# Altium project fullwave_rectifier.PrjPcb
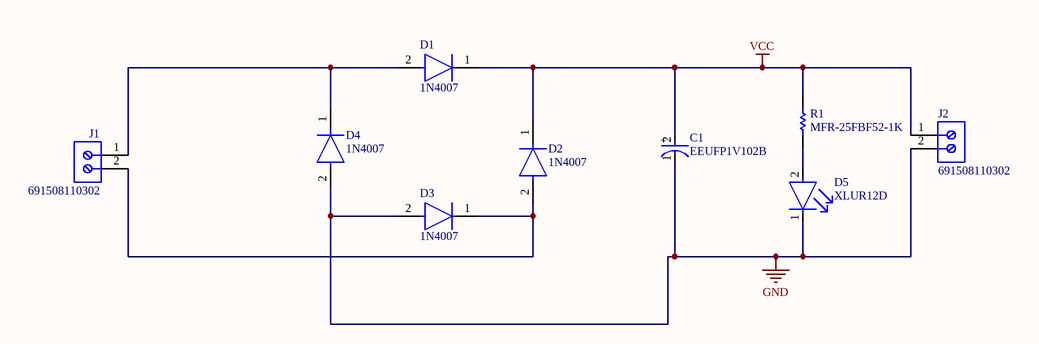
[diagram p0: Sheet1.SchDoc]
1 sheet, 9 parts. Net scope: global (net labels, ports and power ports of the same name join across sheets).
Board file: PCB1.PcbDoc

## Sheet Sheet1.SchDoc
size A; SheetNumber: 1; SheetTotal: 1

### Parts
C1  EEUFP1V102B  [FP-RAD-TH-D_12_5_0_5-L_20-MFG]
D1  1N4007  [FP-1N4007-MFG]
D2  1N4007  [FP-1N4007-MFG]
D3  1N4007  [FP-1N4007-MFG]
D4  1N4007  [FP-1N4007-MFG]
D5  XLUR12D  [FP-XLUR12D-MFG]
J1  691508110302  [691508110302]
J2  691508110302  [691508110302]
R1  MFR-25FBF52-1K  [RESA60-630X240]

### Nets
GND: C1.1(C) D3.2(A) D4.2(A) D5.1(C) J2.2
VCC: C1.2(A) D1.1(C) D2.1(C) J2.1 R1.2
NetD1_2: D1.2(A) D4.1(C) J1.1
NetD2_2: D2.2(A) D3.1(C) J1.2
NetD5_2: D5.2(A) R1.1

### Notes on the sheet
- (in symbol CMP-05427-001378-1) +

### Library data of the parts
C1 = CMP-05427-001378-1: Aluminum Electrolytic Capacitors (Radial Lead Type) AEC-Q200 Qualified 1000uF ±20% 35V; RoHS Compliant: Yes
D1-D4 = CMP-123542-000001-1: Rectifier diode 1000 V 1 A DO-41, ,; Manufacturer: Diotec; Max Surge Forward Current: 27A; Forward Current: 1A; Max Junction Temp: +175°C; Reverse Voltage: 1000V; Value: 15pF; Peak Reverse Current: 5uA; Category: Diode; Temperature Range Low: -50°C; Automotive: No; Temperature: -50°C to +175°C; Lead Free: Yes; ComponentLink2Description: Datasheet; Max Repetitive Reverse Voltage: 1000V; ComponentLink2URL: https://datasheet.octopart.com/1N4007-Diotec-datasheet-62346875.pdf; Manufacturer Part Number: 1N4007; Device Class L3: Rectifier Diodes; Height: 2.8mm; Octopart: https://octopart.com/1n4007-diotec-4040411; Package: 1N4007; Temperature Range High: +175°C; Device Class L1: Discrete Semiconductors; Device Class L2: Diodes; RoHS: TRUE; Capacitance: 15pF; Ipc Land Pattern Name: DIOAD888W100L520D280
D5 = CMP-02085-08376351-1: 627nm Red LED; 5x8.6mm, Through-Hole Mount with Red Diffused Round Lamp; Test Current: 10mA; Viewing Angle: 30°; Dominant Wavelength: 617nm; Luminous Intensity: 39mcd; Forward Voltage: 1.9V; Wavelength: 627nm; Case/Package: Radial; Lens Color: Red; Mount: Through Hole; Height: 8.6mm; Color: Red; Lifecycle Status: Production; Lens Transparency: Diffused; RoHS: Compliant
J1 J2 = CMP-1502-02490-3: 5081 Series 3.5MM Pitch Horizontal, Pcb Terminal Block, Surface Mount, 2 Way; Number of Positions Per Level: 2; Current: 10A; Wire Gauge (Min): 16AWG; Number of Levels: 1; Plating: Brass, Steel, Tin; Wire Gauge (Max): 30AWG; Voltage: 300V; Lead Pitch: 3.5mm; Pitch: 3.5mm; Mount: Surface Mount; Number of Pins: 2; Color: Black; Max Operating Temperature: 130°C; Length: 7mm; Housing Material: Polymer; RoHS: Compliant; Contact Plating: Tin; Termination: Screw; Min Operating Temperature: -40°C
R1 = CMP-1659-00075-1: Axial Resistor, 1 KOhm, +/- 1%, 250 mW, -55 to 155 degC, 2-Pin THD, RoHS, Bulk; Voltage Rating: 250 V; Resistance: 10 kohm; Power Rating: 250 mW; ComponentLink2Description: Datasheet; RoHSCompliant: true; PackageReference: MFR-25; Case\Package: Axial; Max Operating Temperature: 155 degC; DatasheetVersion: Apr-13; Tolerance: 1%; ComponentLink1URL: http://www.yageo.com/; Length: 0.248 inch; ComponentLink2URL: http://www.yageo.com/documents/recent/Yageo%20LR_MFR_2013.pdf; Packaging: Bulk; Package Quantity: 200; PackageDescription: 2-Pin Axial Lead, Dia 2.4 mm, Body Length 6.3 mm; Min Operating Temperature: -55 degC; ComponentLink1Description: Manufacturer URL